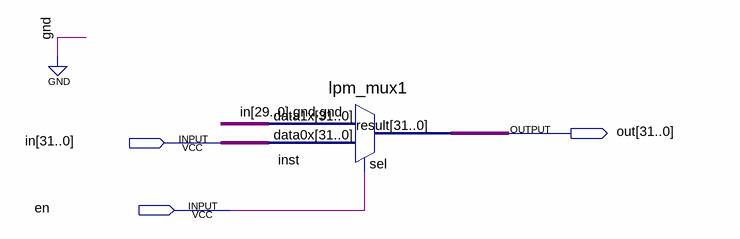
[diagram p0: schematic sheet]
// Quartus schematic shift_left_2bit.bdf as structural Verilog: 1 symbols, 3 pins
module shift_left_2bit (
  input  [31:0] in,
  input  en,
  output [31:0] out
);

  lpm_mux1 inst (.data1x({in[29:0], 2'b00}), .data0x(in), .sel(en), .result(out));
endmodule
